# Altium schematic sheet TI_DSP.SchDoc
size A
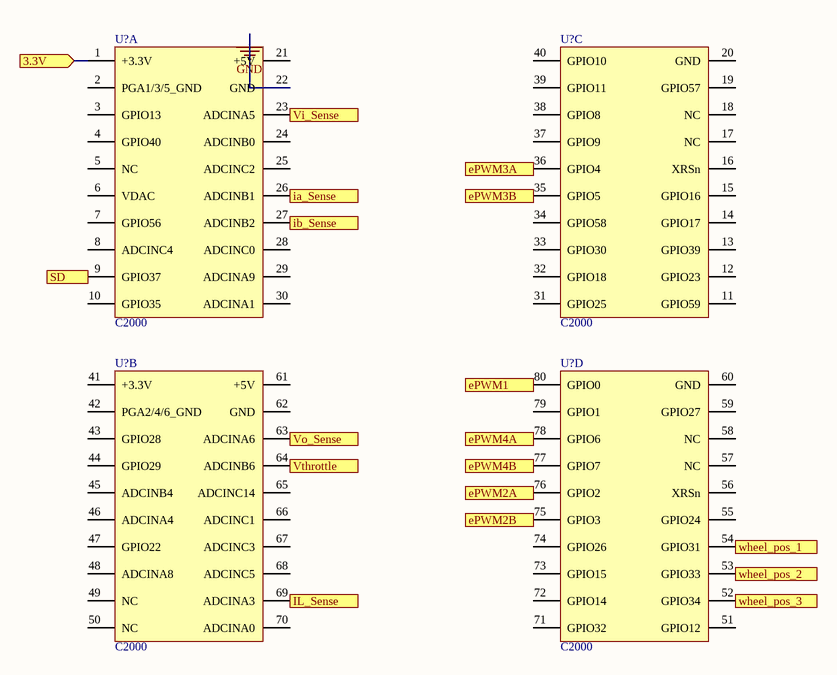
[diagram p0: TI_DSP.SchDoc]

## Parts
(Parts that share a designator on the sheet are numbered #1, #2 ... from top to bottom, then left to right.)
U?#1  C2000  [C2000]  (part C of 4)
U?#2  C2000  [C2000]  (part A of 4)
U?#3  C2000  [C2000]  (part B of 4)
U?#4  C2000  [C2000]  (part D of 4)

## Ports
3.3V (in), ePWM1 (out), ePWM2A (out), ePWM2B (out), ePWM3A (out), ePWM3B (out), ePWM4A (out), ePWM4B (out), ia_Sense (in), ib_Sense (in), IL_Sense (in), SD (out), Vi_Sense (in), Vo_Sense (in), Vthrottle (in), wheel_pos_1 (in), wheel_pos_2 (in), wheel_pos_3 (in)

## Nets
GND: U?#2.22(GND)
3.3V: U?#2.1(+3.3V) ; port 3.3V
ePWM1: U?#4.80(GPIO0) ; port ePWM1
ePWM2A: U?#4.76(GPIO2) ; port ePWM2A
ePWM2B: U?#4.75(GPIO3) ; port ePWM2B
ePWM3A: U?#1.36(GPIO4) ; port ePWM3A
ePWM3B: U?#1.35(GPIO5) ; port ePWM3B
ePWM4A: U?#4.78(GPIO6) ; port ePWM4A
ePWM4B: U?#4.77(GPIO7) ; port ePWM4B
ia_Sense: U?#2.26(ADCINB1) ; port ia_Sense
ib_Sense: U?#2.27(ADCINB2) ; port ib_Sense
IL_Sense: U?#3.69(ADCINA3) ; port IL_Sense
SD: U?#2.9(GPIO37) ; port SD
Vi_Sense: U?#2.23(ADCINA5) ; port Vi_Sense
Vo_Sense: U?#3.63(ADCINA6) ; port Vo_Sense
Vthrottle: U?#3.64(ADCINB6) ; port Vthrottle
wheel_pos_1: U?#4.54(GPIO31) ; port wheel_pos_1
wheel_pos_2: U?#4.53(GPIO33) ; port wheel_pos_2
wheel_pos_3: U?#4.52(GPIO34) ; port wheel_pos_3

Not connected (* = marked no-connect by the designer): U?#1 11(GPIO59) 12(GPIO23) 13(GPIO39) 14(GPIO17) 15(GPIO16) 16(XRSn) 17(NC) 18(NC) 19(GPIO57) 20(GND) 31(GPIO25) 32(GPIO18) 33(GPIO30) 34(GPIO58) 37(GPIO9) 38(GPIO8) 39(GPIO11) 40(GPIO10); U?#2 2(PGA1/3/5_GND) 3(GPIO13) 4(GPIO40) 5(NC) 6(VDAC) 7(GPIO56) 8(ADCINC4) 10(GPIO35) 21(+5V) 24(ADCINB0) 25(ADCINC2) 28(ADCINC0) 29(ADCINA9) 30(ADCINA1); U?#3 41(+3.3V) 42(PGA2/4/6_GND) 43(GPIO28) 44(GPIO29) 45(ADCINB4) 46(ADCINA4) 47(GPIO22) 48(ADCINA8) 49(NC) 50(NC) 61(+5V) 62(GND) 65(ADCINC14) 66(ADCINC1) 67(ADCINC3) 68(ADCINC5) 70(ADCINA0); U?#4 51(GPIO12) 55(GPIO24) 56(XRSn) 57(NC) 58(NC) 59(GPIO27) 60(GND) 71(GPIO32) 72(GPIO14) 73(GPIO15) 74(GPIO26) 79(GPIO1)

## Library data of the parts
U?#1-U?#4 = C2000: F280049C; Parameter 1: test 2